# EAGLE design ai_ardushield_motor (EAGLE 6.5.0)
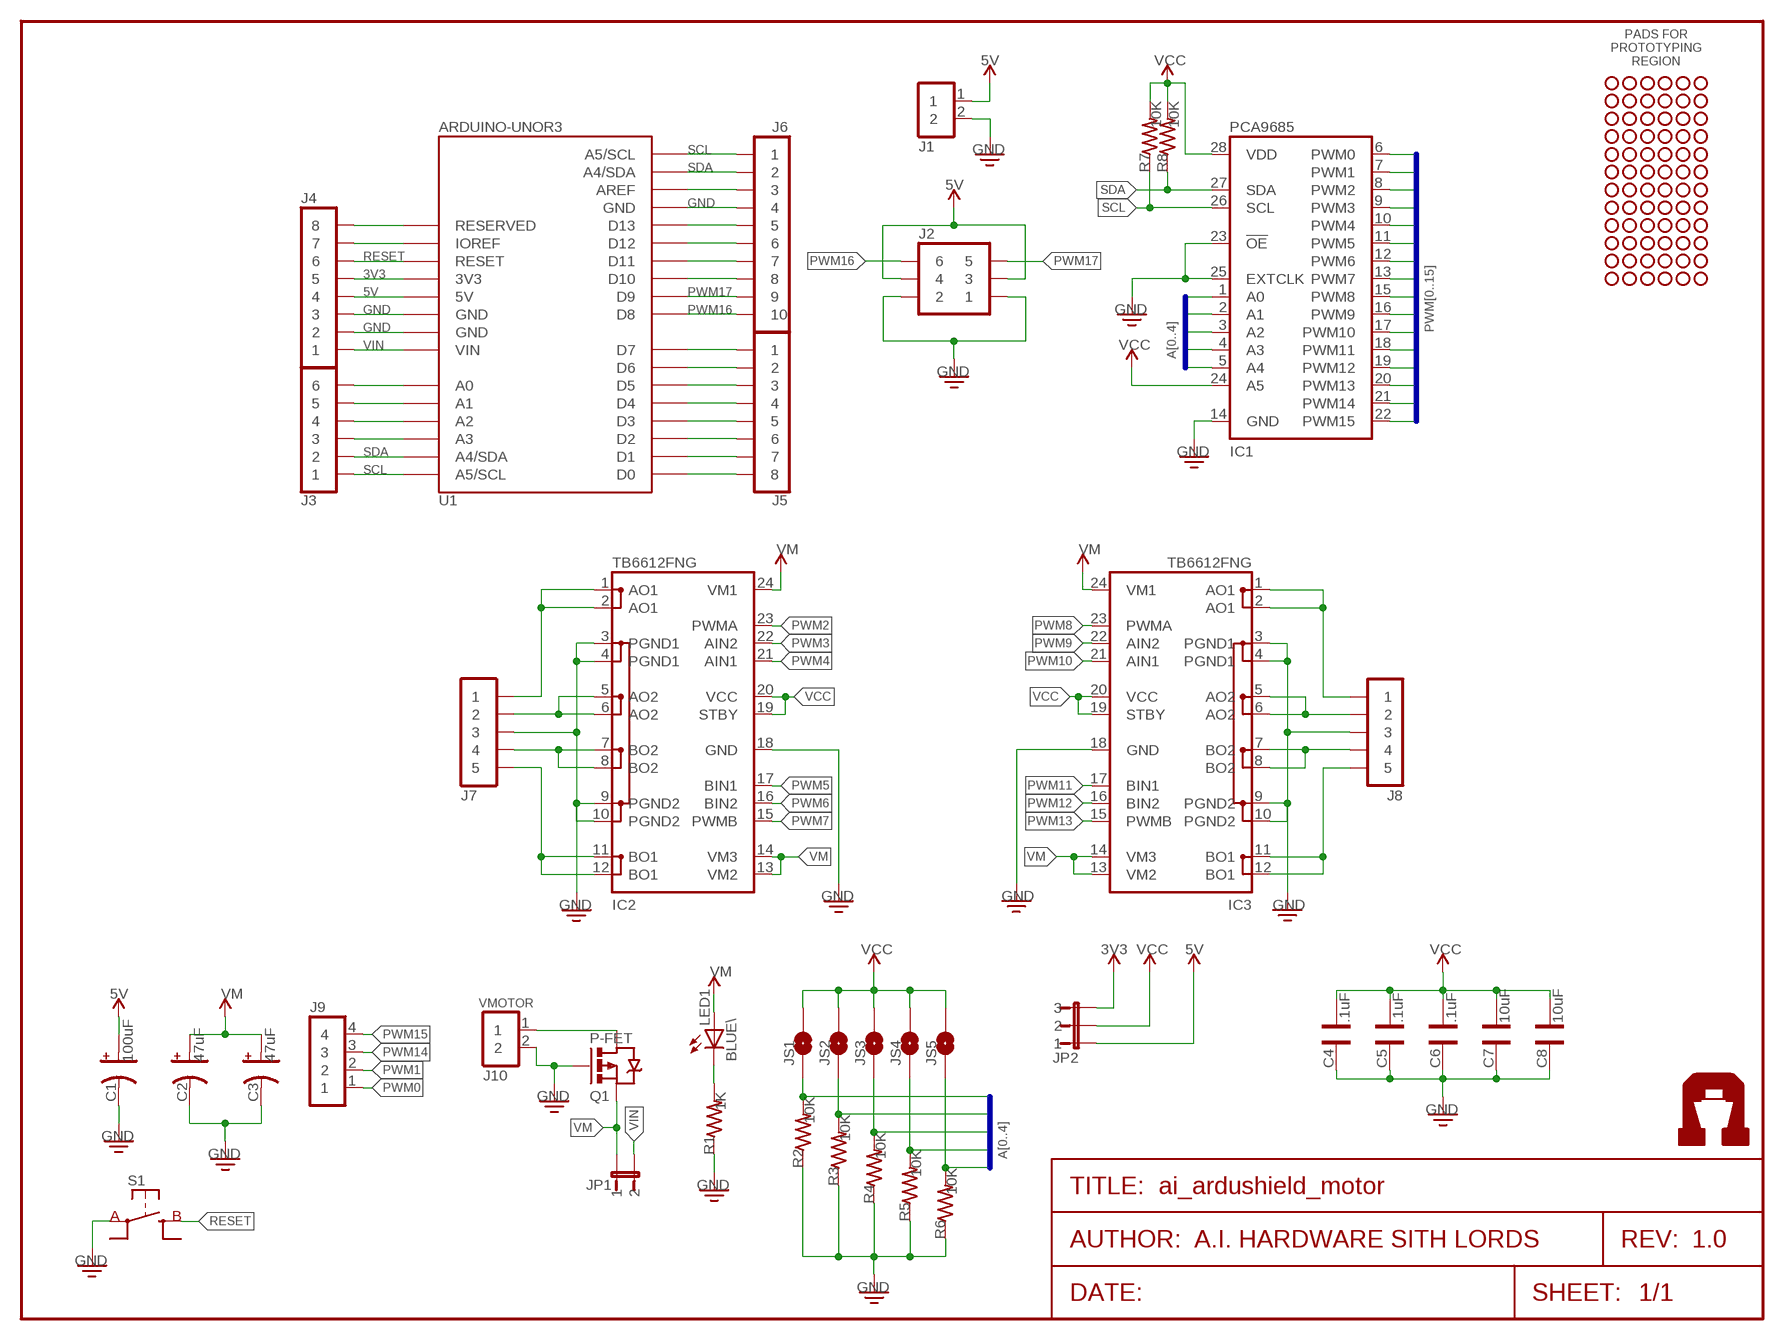
[diagram p0: schematic, sheet 1]
FRAME1 (FRAME-LETTER): AUTHOR: A.I. HARDWARE SITH LORDS; REV: 1.0

## Parts
C1  100uF  CAP-POLPANASONIC-C  [CAP-PANASONIC-C]
C2  47uF  CAP-POLPANASONIC-C  [CAP-PANASONIC-C]
C3  47uF  CAP-POLPANASONIC-C  [CAP-PANASONIC-C]
C4  .1uF  CAP0603  [CAP-0603]
C5  .1uF  CAP0603  [CAP-0603]
C6  .1uF  CAP0603  [CAP-0603]
C7  10uF  CAP0603  [CAP-0603]
C8  10uF  CAP0603  [CAP-0603]
IC1  PCA9685  [TSSOP28]
IC2  TB6612FNG  [SSOP24]
IC3  TB6612FNG  [SSOP24]
J1  1X02ST  [1X02-ST]
J2  2X03  [2X03]
J3  1X06  [1X06]
J4  1X08  [1X08]
J5  1X08  [1X08]
J6  1X10  [1X10]
J7  1X05ST  [1X05-ST]
J8  1X05ST  [1X05-ST]
J9  1X04  [1X04]
J10  1X02ST  [1X02-ST]
J11  1X06-PROTO  [1X06-NOFIRST]
J12  1X06-PROTO  [1X06-NOFIRST]
J13  1X06-PROTO  [1X06-NOFIRST]
J14  1X06-PROTO  [1X06-NOFIRST]
J15  1X06-PROTO  [1X06-NOFIRST]
J16  1X06-PROTO  [1X06-NOFIRST]
J17  1X06-PROTO  [1X06-NOFIRST]
J18  1X06-PROTO  [1X06-NOFIRST]
J19  1X06-PROTO  [1X06-NOFIRST]
J20  1X06-PROTO  [1X06-NOFIRST]
J21  1X06-PROTO  [1X06-NOFIRST]
J22  1X06-PROTO  [1X06-NOFIRST]
JP1  1X02-PJ  [1X02]
JP2  1X03-PJ  [1X03]
JS1  1X02-SJNO  [1X02-SJ-NO]
JS2  1X02-SJNO  [1X02-SJ-NO]
JS3  1X02-SJNO  [1X02-SJ-NO]
JS4  1X02-SJNO  [1X02-SJ-NO]
JS5  1X02-SJNO  [1X02-SJ-NO]
LED1  BLUE\  LED0603  [LED-0603]
Q1  P-FET  [TO252]
R1  1K  RES0603  [RES-0603]
R2  10K  RES0603  [RES-0603]
R3  10K  RES0603  [RES-0603]
R4  10K  RES0603  [RES-0603]
R5  10K  RES0603  [RES-0603]
R6  10K  RES0603  [RES-0603]
R7  10K  RES0603  [RES-0603]
R8  10K  RES0603  [RES-0603]
S1  SW-SPSTSMD06X06  [SW-SPST-SMD06X06]
U1  ARDUINOUNOR3  [UNOR3]
U$14  AI-LOGOL  [AI-LOGO-L]

## Nets
3V3 [power]: J4.5 JP2.3 U1.3V3
5V [power]: C1.A J1.1 J2.3 J2.4 J4.4 JP2.1 U1.5V
A0: IC1.1(A0) JS1.1 R2.2
A1: IC1.2(A1) JS2.1 R3.2
A2: IC1.3(A2) JS3.1 R4.2
A3: IC1.4(A3) JS4.1 R5.2
A4: IC1.5(A4) JS5.1 R6.2
GND [power]: C1.C C2.C C3.C C4.2 C5.2 C6.2 C7.2 C8.2 IC1.14(GND) IC1.23(!OE) IC1.25(EXTCLK) IC2.3(PGND1) IC2.4(PGND1) IC2.9(PGND2) IC2.10(PGND2) IC2.18(GND) IC3.3(PGND1) IC3.4(PGND1) IC3.9(PGND2) IC3.10(PGND2) IC3.18(GND) J1.2 J2.1 J2.2 J4.2 J4.3 J6.4 J7.3 J8.3 J10.2 Q1.G R1.1 R2.1 R3.1 R4.1 R5.1 R6.1 S1.A@1(A) S1.A@2(A) U1.GND@1(GND) U1.GND@2(GND) U1.GND@3(GND)
N$1: J5.1 U1.D7
N$2: J5.2 U1.D6
N$4 [power]: LED1.C R1.2
N$5: J3.3 U1.A3
N$6: J3.4 U1.A2
N$7: J3.5 U1.A1
N$8: J3.6 U1.A0
N$15: J4.7 U1.IOREF
N$16: J4.8 U1.RESERVED
N$17: J5.3 U1.D5
N$18: J5.4 U1.D4
N$19: J5.5 U1.D3
N$20: J5.6 U1.D2
N$21: J5.7 U1.D1
N$22: J5.8 U1.D0
N$23 [power]: IC2.1(AO1) IC2.2(AO1) J7.1
N$24 [power]: IC2.5(AO2) IC2.6(AO2) J7.2
N$27: J6.3 U1.AREF
N$29: J6.5 U1.D13
N$30: J6.6 U1.D12
N$31: J6.7 U1.D11
N$32: J6.8 U1.D10
N$35 [power]: IC2.7(BO2) IC2.8(BO2) J7.4
N$36 [power]: IC2.11(BO1) IC2.12(BO1) J7.5
N$38 [power]: IC3.1(AO1) IC3.2(AO1) J8.1
N$39 [power]: IC3.5(AO2) IC3.6(AO2) J8.2
N$40 [power]: IC3.7(BO2) IC3.8(BO2) J8.4
N$41 [power]: IC3.11(BO1) IC3.12(BO1) J8.5
PWM0: IC1.6(PWM0) J9.1
PWM1: IC1.7(PWM1) J9.2
PWM2: IC1.8(PWM2) IC2.23(PWMA)
PWM3: IC1.9(PWM3) IC2.22(AIN2)
PWM4: IC1.10(PWM4) IC2.21(AIN1)
PWM5: IC1.11(PWM5) IC2.17(BIN1)
PWM6: IC1.12(PWM6) IC2.16(BIN2)
PWM7: IC1.13(PWM7) IC2.15(PWMB)
PWM8: IC1.15(PWM8) IC3.23(PWMA)
PWM9: IC1.16(PWM9) IC3.22(AIN2)
PWM10: IC1.17(PWM10) IC3.21(AIN1)
PWM11: IC1.18(PWM11) IC3.17(BIN1)
PWM12: IC1.19(PWM12) IC3.16(BIN2)
PWM13: IC1.20(PWM13) IC3.15(PWMB)
PWM14: IC1.21(PWM14) J9.3
PWM15: IC1.22(PWM15) J9.4
PWM16: J2.6 J6.10 U1.D8
PWM17: J2.5 J6.9 U1.D9
RESET [power]: J4.6 S1.B@1(B) S1.B@2(B) U1.RESET
SCL: IC1.26(SCL) J3.1 J6.1 R7.1 U1.A5/SCL@1(A5/SCL) U1.A5/SCL@2(A5/SCL)
SDA: IC1.27(SDA) J3.2 J6.2 R8.1 U1.A4/SDA@1(A4/SDA) U1.A4/SDA@2(A4/SDA)
VCC [power]: C4.1 C5.1 C6.1 C7.1 C8.1 IC1.24(A5) IC1.28(VDD) IC2.19(STBY) IC2.20(VCC) IC3.19(STBY) IC3.20(VCC) JP2.2 JS1.2 JS2.2 JS3.2 JS4.2 JS5.2 R7.2 R8.2
VIN [power]: J4.1 JP1.2 U1.VIN
VM [power]: C2.A C3.A IC2.13(VM2) IC2.14(VM3) IC2.24(VM1) IC3.13(VM2) IC3.14(VM3) IC3.24(VM1) JP1.1 LED1.A Q1.S
VMOTOR [power]: J10.1 Q1.D
Unconnected: J11.1 J11.2 J11.3 J11.4 J11.5 J11.6 J12.1 J12.2 J12.3 J12.4 J12.5 J12.6 J13.1 J13.2 J13.3 J13.4 J13.5 J13.6 J14.1 J14.2 J14.3 J14.4 J14.5 J14.6 J15.1 J15.2 J15.3 J15.4 J15.5 J15.6 J16.1 J16.2 J16.3 J16.4 J16.5 J16.6 J17.1 J17.2 J17.3 J17.4 J17.5 J17.6 J18.1 J18.2 J18.3 J18.4 J18.5 J18.6 J19.1 J19.2 J19.3 J19.4 J19.5 J19.6 J20.1 J20.2 J20.3 J20.4 J20.5 J20.6 J21.1 J21.2 J21.3 J21.4 J21.5 J21.6 J22.1 J22.2 J22.3 J22.4 J22.5 J22.6

## Buses
PWM[0..15]
A[0..4]

## Notes on the sheet
- PADS FOR
  PROTOTYPING
  REGION
- VMOTOR

## Library data of the parts
C1-C3 = Ai_Passives:CAP-POL: Polarized Capacitor Normally 10uF, 47uF, and 100uF in electrolytic and tantalum varieties.
C4-C8 = Ai_Passives:CAP
IC1 = Ai_IC:PCA9685: PCA9685 - 16 Channel 12-Bit I2C PWM Controller 5.0V tolerant 16 channel, 12-bit I2C PWM controller with 25mA per output (max. 400mA total) Digikey: 568-5931-1-ND
IC2 IC3 = Ai_IC:TB6612FNG: TB6612FNG MOS dual H-bridge motor driver, 1.2A current 3.2A peak 3 or 5v logic and 3-15v motor
J1 J10 = Ai_Connectors:1X02
J2 = Ai_Connectors:2X03
J3 = Ai_Connectors:1X06
J4 J5 = Ai_Connectors:1X08
J6 = Ai_Connectors:1X10
J7 J8 = Ai_Connectors:1X05
J9 = Ai_Connectors:1X04
J11-J22 = Ai_Connectors:1X06-PROTO
JP1 = Ai_Connectors:1X02-PJ
JP2 = Ai_Connectors:1X03-PJ
JS1-JS5 = Ai_Connectors:1X02-SJ: Solder Jumper Standard SMD solder jumper. Used to automate production. Two varients : Normally Open and Normally Closed are the same, but have different paste layers. NC will have a large amount of paste and should jumper during reflow.
LED1 = Ai_LED:LED
Q1 = Ai_DiscreteSemis:P-FET: Generic PMOSFET
R1-R8 = Ai_Passives:RES
S1 = Ai_Electromechanical:SW-SPST
U1 = Ai_Boards:ARDUINO
U$14 = Ai_Miscellany:AI-LOGO

## Net classes
0 default: width 0.203 mm
1 power: width 0.406 mm

## Board
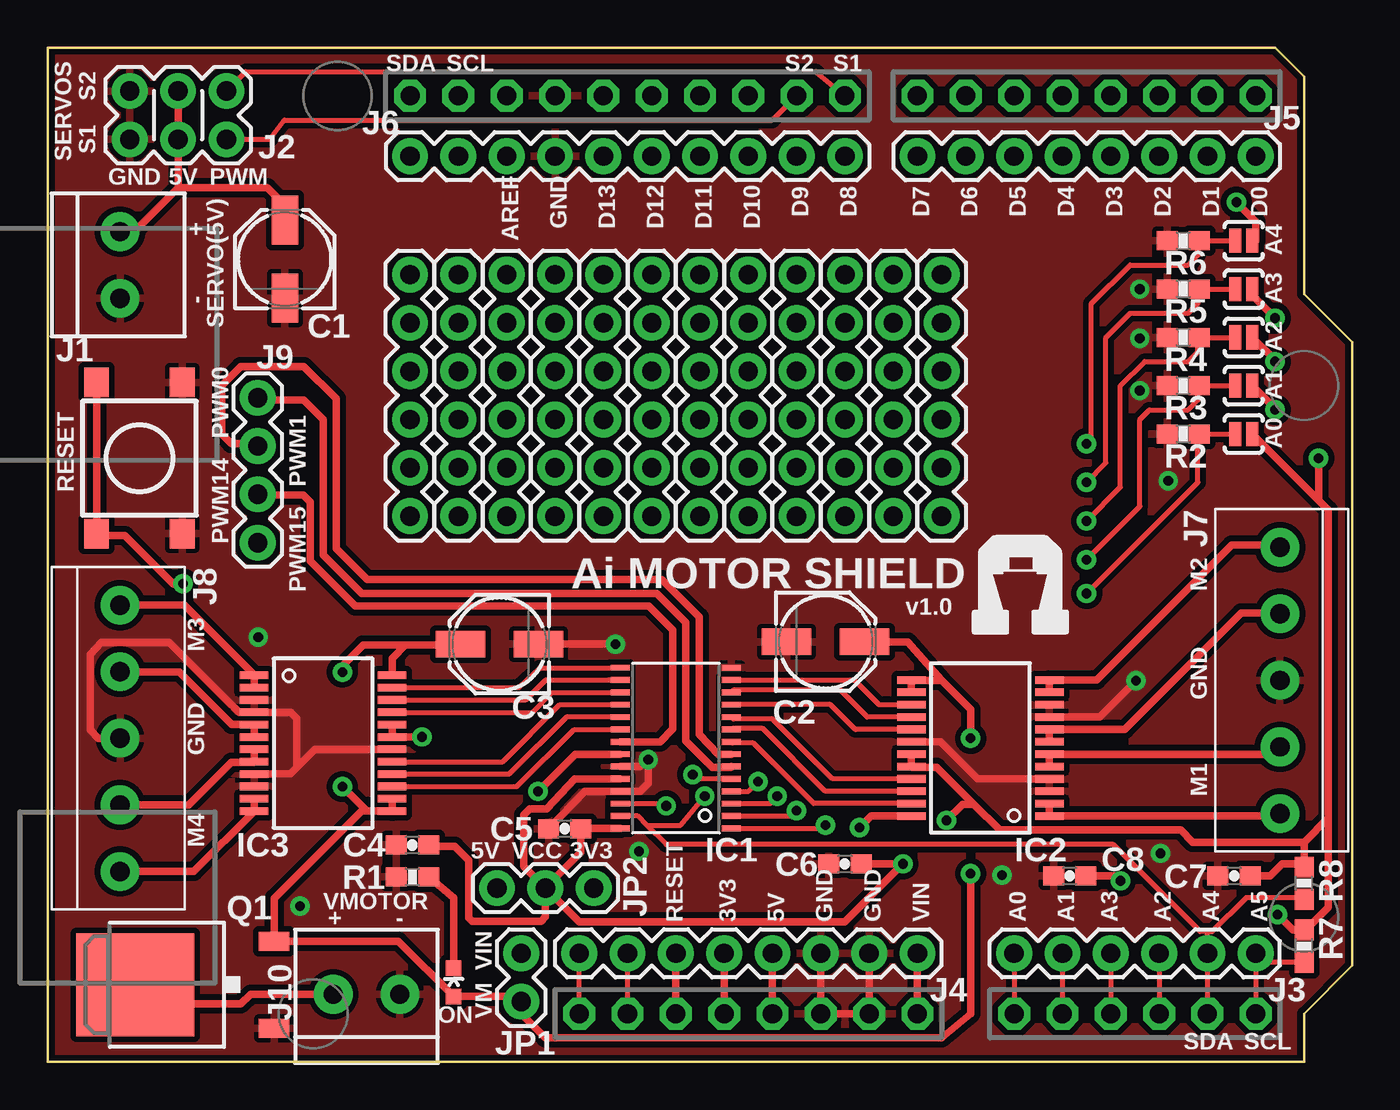
[diagram p1: board, top side]
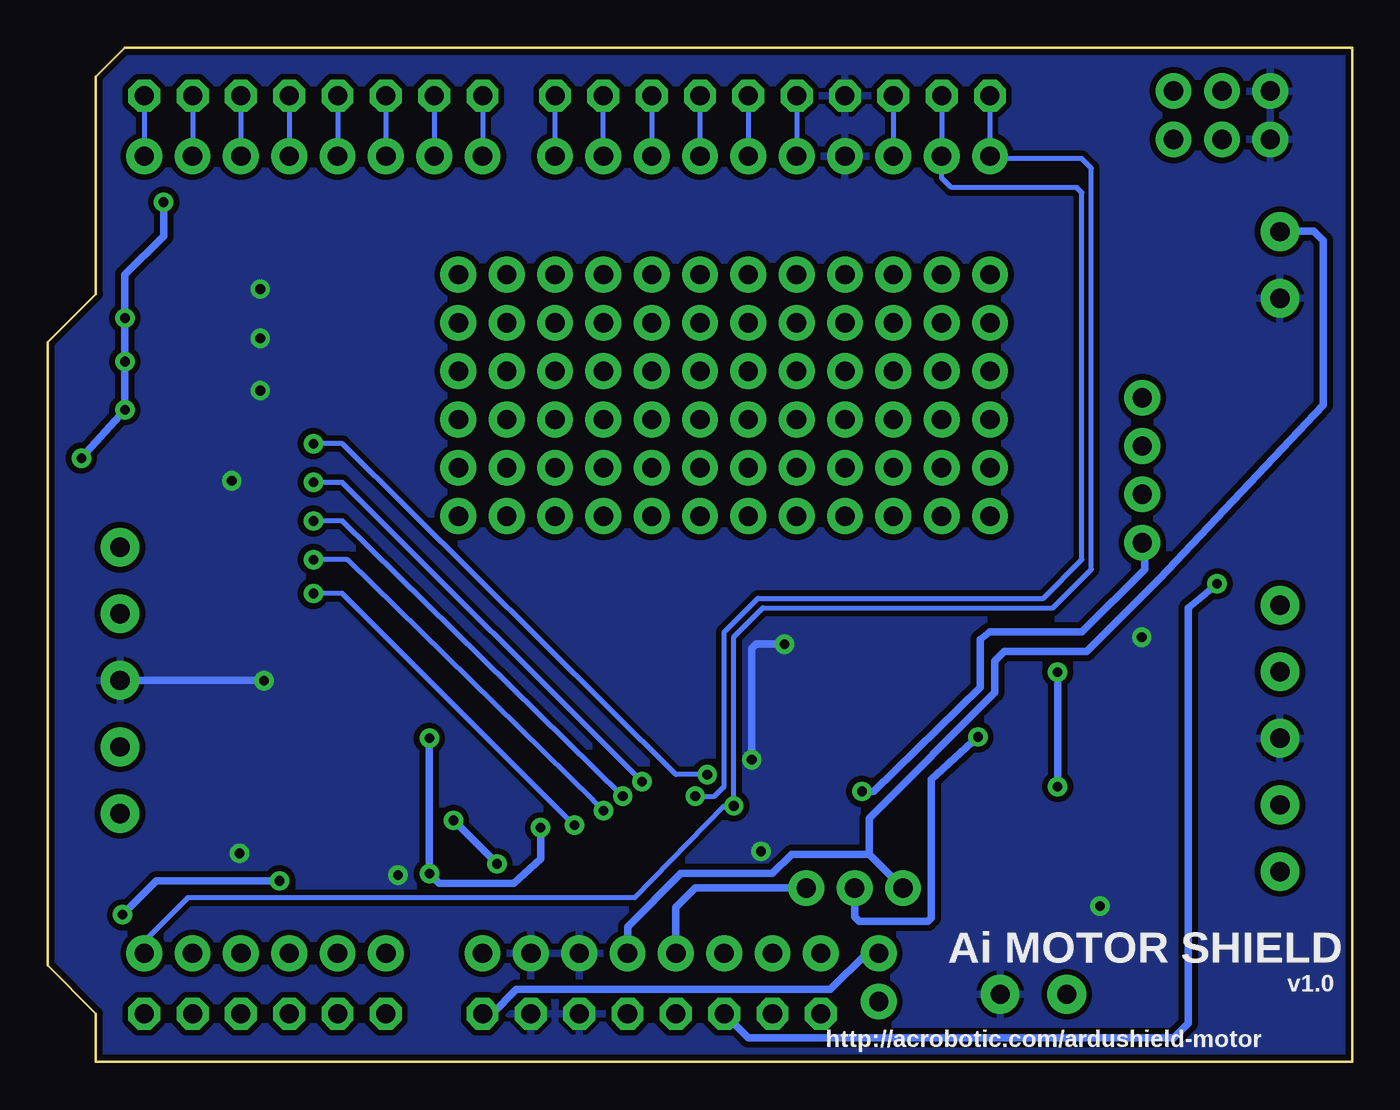
[diagram p2: board, bottom side, seen from below]

Size 68.58 x 53.34 mm. Coordinates in mm from the lower left corner, seen from the top.
Copper layers (1*16): Top 0.035mm / dielectric 1.5mm / Bottom 0.035mm
Design rules "ai_2layer": minimum track width 7mil, minimum drill 15mil, track to track 8mil, track to pad 8mil, pad to pad 8mil, via to via 8mil, smd to smd 8mil, copper to edge 8mil, drill to drill 8mil, minimum pad ring 12mil, minimum via ring 10mil, stop-mask expansion 4mil, vias tented up to drill 20mil, thermal gap 10mil

### Footprints (pad centres in the part's own frame; a part is rotated, then mirrored left to right if it is on the bottom)
CAP-PANASONIC-C = smd 2.6 x 1.4: A 2.05,0; C -2.05,0
CAP-0603 = smd 1.1 x 1: 1 -0.85,0; 2 0.85,0
TSSOP28 = smd 0.305 x 0.991: 1 -4.225,-2.918; 2 -3.575,-2.918; 3 -2.925,-2.918; 4 -2.275,-2.918; 5 -1.625,-2.918; 6 -0.975,-2.918; 7 -0.325,-2.918; 8 0.325,-2.918; 9 0.975,-2.918; 10 1.625,-2.918; 11 2.275,-2.918; 12 2.925,-2.918; 13 3.575,-2.918; 14 4.225,-2.918; 15 4.225,2.918; 16 3.575,2.918; 17 2.925,2.918; 18 2.275,2.918; 19 1.625,2.918; 20 0.975,2.918; 21 0.325,2.918; 22 -0.325,2.918; 23 -0.975,2.918; 24 -1.625,2.918; 25 -2.275,2.918; 26 -2.925,2.918; 27 -3.575,2.918; 28 -4.225,2.918
SSOP24 = smd 0.4 x 1.5: 1 -3.575,-3.625; 2 -2.925,-3.625; 3 -2.275,-3.625; 4 -1.625,-3.625; 5 -0.975,-3.625; 6 -0.325,-3.625; 7 0.325,-3.625; 8 0.975,-3.625; 9 1.625,-3.625; 10 2.275,-3.625; 11 2.925,-3.625; 12 3.575,-3.625; 13 3.575,3.625; 14 2.925,3.625; 15 2.275,3.625; 16 1.625,3.625; 17 0.975,3.625; 18 0.325,3.625; 19 -0.325,3.625; 20 -0.975,3.625; 21 -1.625,3.625; 22 -2.275,3.625; 23 -2.925,3.625; 24 -3.575,3.625
1X02-ST = drill 1.016 pad 2.032: 1 -1.75,0; 2 1.75,0
2X03 = drill 1.016 pad 1.88: 1 -2.54,-1.27; 2 -2.54,1.27; 3 0,-1.27; 4 0,1.27; 5 2.54,-1.27; 6 2.54,1.27
1X06 = drill 1.016 pad 1.88: 1 -6.35,0; 2 -3.81,0; 3 -1.27,0; 4 1.27,0; 5 3.81,0; 6 6.35,0
1X08 = drill 1.016 pad 1.88: 1 -8.89,0; 2 -6.35,0; 3 -3.81,0; 4 -1.27,0; 5 1.27,0; 6 3.81,0; 7 6.35,0; 8 8.89,0
1X10 = drill 1.016 pad 1.88: 1 -11.43,0; 2 -8.89,0; 3 -6.35,0; 4 -3.81,0; 5 -1.27,0; 6 1.27,0; 7 3.81,0; 8 6.35,0; 9 8.89,0; 10 11.43,0
1X05-ST = drill 1.016 pad 2.032: 1 -7,0; 2 -3.5,0; 3 0,0; 4 3.5,0; 5 7,0
1X04 = drill 1.016 pad 1.88: 1 -3.81,0; 2 -1.27,0; 3 1.27,0; 4 3.81,0
1X06-NOFIRST = drill 1.016 pad 1.88: 1 -6.35,0; 2 -3.81,0; 3 -1.27,0; 4 1.27,0; 5 3.81,0; 6 6.35,0
1X02 = drill 1.016 pad 1.88: 1 -1.27,0; 2 1.27,0
1X03 = drill 1.016 pad 1.88: 1 -2.54,0; 2 0,0; 3 2.54,0
1X02-SJ-NO = smd 0.635 x 1.27: 1 -0.45,0; 2 0.45,0
LED-0603 = smd 0.8 x 0.8: A 0,-0.75; C 0,0.75
TO252 = smd 5.4 x 6.2: D 0,2.5 | smd 1 x 1.6: G -2.28,-4.8; S 2.28,-4.8
RES-0603 = smd 1.1 x 1: 1 -0.85,0; 2 0.85,0
SW-SPST-SMD06X06 = smd 1.55 x 1.3: A@1 -3.975,-2.25; A@2 3.975,-2.25; B@1 -3.975,2.25; B@2 3.975,2.25
UNOR3 = drill 1 pad 1.676 octagon: 3V3 35.56,2.54; 5V 38.1,2.54; A0 50.8,2.54; A1 53.34,2.54; A2 55.88,2.54; A3 58.42,2.54; A4/SDA@1 60.96,2.54; A4/SDA@2 21.59,50.8; A5/SCL@1 63.5,2.54; A5/SCL@2 19.05,50.8; AREF 24.13,50.8; D0 63.5,50.8; D1 60.96,50.8; D2 58.42,50.8; D3 55.88,50.8; D4 53.34,50.8; D5 50.8,50.8; D6 48.26,50.8; D7 45.72,50.8; D8 41.91,50.8; D9 39.37,50.8; D10 36.83,50.8; D11 34.29,50.8; D12 31.75,50.8; D13 29.21,50.8; GND@1 43.18,2.54; GND@2 40.64,2.54; GND@3 26.67,50.8; IOREF 30.48,2.54; RESERVED 27.94,2.54; RESET 33.02,2.54; VIN 45.72,2.54

### Placement (x,y rotation side)
C1  12.47,42.21 90 top
C2  40.89,22.1 0 top
C3  23.75,21.97 180 top
C4  19.18,11.4 180 top
C5  27.18,12.27 180 top
C6  41.91,10.41 180 top
C7  62.36,9.78 180 top
C8  53.72,9.78 180 top
IC1  33.02,16.51 90 top
IC2  49.02,16.51 90 top
IC3  14.48,16.76 270 top
J1  3.81,41.91 270 top
J2  6.86,49.78 0 top
J3  57.15,5.71 180 top
J4  36.83,5.71 180 top
J5  54.61,47.62 0 top
J6  30.48,47.62 0 top
J7  64.77,20.07 90 top
J8  3.81,17.02 270 top
J9  11.05,31.11 270 top
J10  16.76,3.56 0 top
J11  19.05,35.05 90 top
J12  21.59,35.05 90 top
J13  24.13,35.05 90 top
J14  26.67,35.05 90 top
J15  29.21,35.05 90 top
J16  31.75,35.05 90 top
J17  34.29,35.05 90 top
J18  36.83,35.05 90 top
J19  39.37,35.05 90 top
J20  41.91,35.05 90 top
J21  44.45,35.05 90 top
J22  46.99,35.05 90 top
JP1  24.89,4.45 90 top
JP2  26.16,9.14 0 top
JS1  62.87,33.02 0 top
JS2  62.87,35.56 0 top
JS3  62.87,38.1 0 top
JS4  62.87,40.64 0 top
JS5  62.87,43.18 0 top
LED1  21.34,4.19 0 top
Q1  7.11,4.06 90 top
R1  19.18,9.73 0 top
R2  59.69,33.02 0 top
R3  59.69,35.56 0 top
R4  59.69,38.1 0 top
R5  59.69,40.64 0 top
R6  59.69,43.18 0 top
R7  66.04,6.1 90 top
R8  66.04,9.4 90 top
S1  4.83,31.75 90 top
U1  0,0 0 top
U$14  51.18,24.64 0 top

### Tracks (layer width: path | path; a pad name or v marks a point on that pad's centre or on a via)
3V3
  Top 0.406: U1.3V3 J4.5
  Bottom 0.406: J4.5 35.56,8.13 34.54,9.14 JP2.3
5V
  Top 0.406: J1.1 4.54,43.66 6.86,45.97 | U1.5V J4.4 | 6.86,45.97 J2.3 J2.4 | 6.86,45.97 11.56,45.97 12.47,45.06 C1.A
  Bottom 0.406: J4.4 38.1,7.11 35.31,9.91 30.48,9.91 29.46,10.92 25.4,10.92 | 25.4,10.92 JP2.1 | 25.4,10.92 25.4,12.8 18.8,19.43 18.8,21.08 18.29,21.59 13.97,21.59 10.16,25.4 1.52,34.54 1.52,43.18 2.03,43.69 3.78,43.69 J1.1
A0  (via drill 0.51)
  Top 0.254: 62.41,33.34 JS1.1 R2.2 60.45,32.93 60.45,30.48 v54.61,24.64 | IC1.1 40.73,12.29 v40.89,12.45
  Bottom 0.254: v40.89,12.45 53.09,24.64 v54.61,24.64
A1  (via drill 0.51)
  Top 0.254: JS2.1 R3.2 60.45,35.47 60.45,34.8 59.94,34.29 57.91,34.29 57.4,33.78 57.4,29.21 v54.61,26.42 | IC1.2 39.1,12.94 v39.37,13.21
  Bottom 0.254: v39.37,13.21 39.88,13.72 52.83,26.42 v54.61,26.42
A2  (via drill 0.51)
  Top 0.254: JS3.1 R4.2 60.45,38.01 60.45,37.34 59.94,36.83 57.66,36.83 56.39,35.56 56.39,30.23 v54.61,28.45 | IC1.3 37.97,13.59 v38.35,13.97
  Bottom 0.254: v38.35,13.97 53.09,28.45 v54.61,28.45
A3  (via drill 0.51)
  Top 0.254: JS4.1 R5.2 60.45,40.55 60.45,39.88 59.94,39.37 56.9,39.37 55.63,38.1 55.63,31.5 v54.61,30.48 | IC1.4 36.84,14.23 v37.34,14.73
  Bottom 0.254: v37.34,14.73 53.09,30.48 v54.61,30.48
A4  (via drill 0.51)
  Top 0.254: JS5.1 R6.2 60.45,43.09 60.45,42.42 59.94,41.91 56.9,41.91 54.86,39.88 54.86,32.77 v54.61,32.51 | IC1.5 34.14,14.88 v33.91,15.11
  Bottom 0.254: v33.91,15.11 35.56,15.11 53.09,32.51 v54.61,32.51
GND  (via drill 0.51)
  Top 0.406: J4.3 U1.GND@2 U1.GND@1 J4.2 | IC2.9 55.3,18.14 v57.2,20.04 | IC2.18 46.94,16.84 48.89,14.88 IC2.4 | J8.3 2.67,17.02 2.23,17.45 2.23,21.44 2.82,22.05 6.4,22.05 10.08,18.39 IC3.4 12.78,18.39 13.11,18.06 13.11,15.49 | IC3.9 12.75,15.14 13.11,15.49 | 13.11,15.49 14.05,16.44 IC3.18 | C5.2 28.24,14.23 IC1.25 30.11,14.22 31.14,14.22 31.57,14.66 v31.57,15.9 31.16,15.54 IC1.23 | v29.84,21.97 C3.C
  Bottom 0.406: v57.2,20.04 57.23,20.07 J7.3 | v29.84,21.97 31.34,21.97 31.57,21.74 v31.57,15.9
  other vias: 58.5,10.97 11.07,22.33 13.26,8.2 50.16,9.83 57.4,40.64 57.4,38.05 57.4,35.31 58.9,30.56 31.09,11.07
  pour Top (isolate 0.305): 0,0 68.58,0 68.58,53.34 0,53.34
  pour Bottom (isolate 0.305): 0,0 68.58,0 68.58,53.34 0,53.34
N$1
  Bottom 0.254: U1.D7 J5.1
N$2
  Bottom 0.254: U1.D6 J5.2
N$4
  Top 0.406: LED1.C 21.34,8.62 R1.2
N$5
  Top 0.254: J3.3 U1.A3
N$6
  Top 0.254: J3.4 U1.A2
N$7
  Top 0.254: J3.5 U1.A1
N$8
  Top 0.254: J3.6 U1.A0
N$15
  Top 0.254: U1.IOREF J4.7
N$16
  Top 0.254: U1.RESERVED J4.8
N$17
  Bottom 0.254: U1.D5 J5.3
N$18
  Bottom 0.254: U1.D4 J5.4
N$19
  Bottom 0.254: U1.D3 J5.5
N$20
  Bottom 0.254: U1.D2 J5.6
N$21
  Bottom 0.254: U1.D1 J5.7
N$22
  Bottom 0.254: U1.D0 J5.8
N$23
  Top 0.406: J7.1 64.64,12.94 IC2.1 IC2.2
N$24
  Top 0.406: J7.2 64.39,16.18 IC2.6 IC2.5
N$27
  Bottom 0.254: U1.AREF J6.3
N$29
  Bottom 0.254: U1.D13 J6.5
N$30
  Bottom 0.254: U1.D12 J6.6
N$31
  Bottom 0.254: U1.D11 J6.7
N$32
  Bottom 0.254: U1.D10 J6.8
N$35
  Top 0.406: IC2.7 IC2.8 56.6,17.48 62.74,23.62 64.71,23.62 J7.4
N$36
  Top 0.406: J7.5 64.66,27.18 62.23,27.18 55.14,20.09 IC2.12 IC2.11
N$38
  Top 0.406: IC3.2 IC3.1 7.17,24.02 J8.1
N$39
  Top 0.406: IC3.6 IC3.5 9.69,17.74 6.91,20.52 J8.2
N$40
  Top 0.406: IC3.7 IC3.8 10.81,15.75 9.65,15.75 7.42,13.52 J8.4
N$41
  Top 0.406: J8.5 7.68,10.02 IC3.12 IC3.11
PWM0
  Top 0.406: J9.1 11.18,34.8 13.46,34.8 14.48,33.78 14.48,26.67 16.51,24.64 32,24.64 33.53,23.11 33.53,16.89 34.92,15.49 35.9,15.49 IC1.6
PWM1
  Top 0.406: IC1.7 35.25,16.18 34.24,17.22 34.24,23.39 32.28,25.38 16.79,25.38 15.16,27 15.16,34.87 13.46,36.58 10.16,36.58 9.14,35.56 9.14,33.02 9.65,32.51 10.92,32.51 J9.2
PWM2
  Top 0.254: IC2.23 40.26,13.59 37.08,16.76 36.01,16.76 IC1.8
PWM3
  Top 0.254: IC2.22 40.88,14.23 37.59,17.53 35.98,17.53 IC1.9
PWM4
  Top 0.254: IC2.21 41.25,14.88 38.1,18.03 36.04,18.03 IC1.10
PWM5
  Top 0.254: IC2.17 42.46,17.48 41.15,18.8 IC1.11
PWM6
  Top 0.254: IC2.16 43.08,18.14 41.66,19.56 36.06,19.56 IC1.12
PWM7
  Top 0.254: IC1.13 42.4,20.09 43.69,18.8 45.26,18.8 IC2.15
PWM8
  Top 0.254: IC3.23 24.77,19.69 25.86,20.73 29.93,20.73 IC1.15
PWM9
  Top 0.254: IC3.22 25.14,19.04 26.19,20.09 29.52,20.09 IC1.16
PWM10
  Top 0.254: IC3.21 25.5,18.39 26.52,19.43 29.92,19.43 IC1.17
PWM11
  Top 0.254: IC3.17 23.92,15.79 26.92,18.8 IC1.18
PWM12
  Top 0.254: IC1.19 27.28,18.14 24.26,15.14 22.99,15.14 IC3.16
PWM13
  Top 0.254: IC1.20 30.06,17.48 27.69,17.48 24.65,14.49 IC3.15
PWM14
  Top 0.406: J9.3 11.07,29.82 13.44,29.82 13.82,29.44 13.82,26.34 16.18,23.98 31.6,23.98 32.87,22.71 32.87,17.5 32.2,16.84 IC1.21
PWM15  (via drill 0.51)
  Top 0.406: IC1.22 27.74,16.18 v25.78,14.22
  Bottom 0.406: v25.78,14.22 25.15,14.22 19.56,19.68 19.56,22.23 19.05,22.61 14.22,22.61 10.92,25.91 10.92,27.18 J9.4
PWM16
  Top 0.254: U1.D8 40.39,52.07 10.41,52.07 J2.6
  Bottom 0.254: J6.10 U1.D8
PWM17
  Top 0.254: U1.D9 38.1,49.53 12.45,49.53 11.68,48.51 J2.5
  Bottom 0.254: J6.9 U1.D9
RESET  (via drill 0.51)
  Top 0.406: J4.6 U1.RESET | v7.11,25.15 6.6,25.15 4.06,27.69 2.67,27.69 S1.B@1 S1.B@2
  Bottom 0.406: U1.RESET 31.75,1.27 9.4,1.27 8.64,2.03 8.64,23.88 v7.11,25.15
SCL  (via drill 0.51)
  Top 0.254: U1.A5/SCL@1 J3.1 63.97,5.25 R7.1 | IC1.26 32.38,13.59 v32.51,13.46
  Bottom 0.254: J3.1 63.5,6.35 61.21,8.64 37.72,8.64 33.02,13.46 v32.51,13.46 32.51,22.35 30.99,23.88 15.75,23.88 13.72,25.91 13.72,46.99 14.22,47.5 18.92,47.5 J6.1 U1.A5/SCL@2
SDA  (via drill 0.51)
  Top 0.254: U1.A4/SDA@1 J3.2 60.96,6.86 | 60.96,6.86 60.58,6.86 56.01,11.43 32.51,11.43 31.5,12.45 | IC1.27 30.12,12.95 30.99,12.95 31.5,12.45 | 60.96,6.86 61.21,6.86 62.99,8.64 65.95,8.64 R8.1 | 31.5,12.45 33.27,12.45 v34.54,13.97
  Bottom 0.254: v34.54,13.97 33.53,13.97 33.02,14.48 33.02,22.61 31.24,24.38 16.26,24.38 14.22,26.42 14.22,45.72 14.48,45.97 21.08,45.97 21.59,46.48 J6.2 U1.A4/SDA@2
VCC  (via drill 0.51)
  Top 0.406: 66.8,29.53 67.31,29.02 67.31,12.83 | 66.8,29.53 JS1.2 | 67.31,12.83 67.31,8.13 66.13,6.95 R7.2 65.44,6.95 v64.64,7.75 | 66.04,11.56 R8.2 65.87,10.41 64.9,10.41 64.26,9.78 C7.1 | 66.04,11.56 67.31,12.83 | 66.04,11.56 60.2,11.56 59.56,12.19 50.04,12.19 48.68,13.55 | 48.68,13.55 46.74,15.49 45.44,15.49 IC2.20 IC2.19 | JP2.2 27.94,7.37 41.91,7.37 v44.96,10.41 C6.1 | v47.24,12.7 48.09,13.55 48.68,13.55 | JS4.2 63.31,40.32 v64.52,39.12 | v66.8,31.75 66.8,29.53 | JS5.2 63.5,43.18 63.5,44.2 v62.48,45.21 | C8.1 56.13,9.78 v56.39,9.53 | IC1.24 27.71,14.88 26.24,13.31 25.35,13.31 25.02,13.01 25.02,10.29 JP2.2 | C4.1 20.1,11.33 21.41,11.33 22.15,10.59 22.15,7.57 22.31,7.4 25.95,7.4 26.16,7.62 JP2.2 | v19.68,17.09 IC3.19 IC3.20 | JS3.2 64.52,36.9 v64.52,36.83 | JP2.2 28.03,11.01 C5.1 28.05,12.29 IC1.28 | JS2.2 64.52,34.36 v64.52,34.29
  Bottom 0.406: v44.96,10.41 v47.24,12.7 | JP2.2 26.16,7.62 25.93,7.39 22.33,7.39 22.15,7.57 22.15,14.86 v19.68,17.09 | v66.8,31.75 v64.52,34.29 v64.52,36.83 v64.52,39.12 64.52,41.4 62.48,43.43 v62.48,45.21 | v56.39,9.53 62.87,9.53 v64.64,7.75
VIN
  Top 0.406: U1.VIN J4.1
  Bottom 0.406: JP1.2 25.53,5.71 27.43,3.81 43.94,3.81 45.21,2.54 U1.VIN
VM  (via drill 0.51)
  Top 0.406: 16.76,13.21 16.51,13.21 11.91,8.61 Q1.S 18.43,6.34 LED1.A 24.63,3.44 JP1.1 24.89,2.54 26.16,1.27 46.99,1.27 48.51,2.54 v48.51,9.91 | 16.76,13.21 18.08,13.21 IC3.13 IC3.14 | v48.51,17.02 48.51,18.54 46.99,20.07 | 46.99,20.07 45.29,20.07 IC2.13 IC2.14 | 46.99,20.07 45.21,22.1 C2.A | 18.8,21.92 16.58,21.92 15.49,20.83 v15.49,20.5 | IC3.24 18.1,21.22 18.8,21.92 | IC2.24 43.29,12.94 v42.67,12.32 | 18.8,21.92 21.7,21.92 C3.A | v15.49,14.48 16.76,13.21
  Bottom 0.406: v48.51,17.02 v48.51,9.91 48.01,9.4 44.07,9.4 42.67,10.67 v42.67,12.32 | v15.49,20.5 v15.49,14.48
VMOTOR
  Top 0.406: J10.1 10.67,3.56 10.16,3.05 4.61,3.05 Q1.D

### Text on the board
tPlace: SDA | SCL | S2 | S1 | S2 | S1 | SERVOS | GND | 5V | PWM | GND | D13 | D12 | D11 | D10 | D9 | D8 | D7 | D6 | D5 | D4 | D3 | D2 | D1 | D0 | + | AREF | A4 | - | A3 | SERVO(5V) | PWM0 | A2 | A1 | PWM1 | PWM14 | A0 | RESET | PWM15 | Ai MOTOR SHIELD | M2 | v1.0 | M3 | GND | GND | M1 | M4 | 5V | VCC | 3V3 | VMOTOR | + | - | RESET | 3V3 | 5V | GND | GND | VIN | A0 | A1 | A3 | A2 | A4 | A5 | VIN | ON | VM | SDA | SCL
bPlace: Ai MOTOR SHIELD | v1.0 | http://acrobotic.com/ardushield-motor